# Altium schematic sheet quad_spi_flash.SchDoc
size A
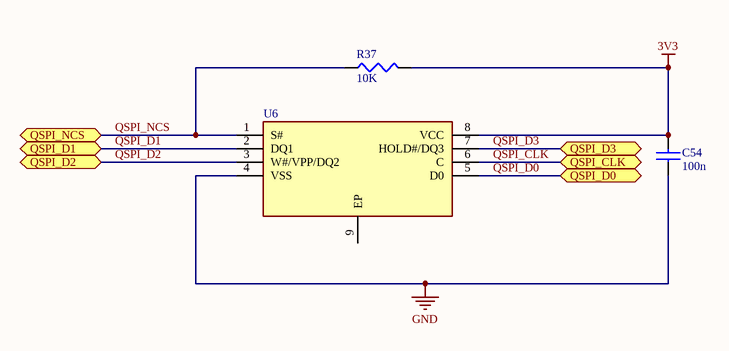
[diagram p0: quad_spi_flash.SchDoc]

## Parts
C54  100n  [C0402]
R37  10K  [R0402]
U6  N25Q128A13EF840E  [SON127P800X600X100-9N-D]  (value not drawn)

## Ports
QSPI_CLK (bidir), QSPI_D0 (bidir), QSPI_D1 (bidir), QSPI_D2 (bidir), QSPI_D3 (bidir), QSPI_NCS (bidir)

## Nets
3V3: C54.2 R37.2 U6.8(VCC)
GND: C54.1 U6.4(VSS)
QSPI_CLK: U6.6(C) ; port QSPI_CLK
QSPI_D0: U6.5(D0) ; port QSPI_D0
QSPI_D1: U6.2(DQ1) ; port QSPI_D1
QSPI_D2: U6.3(W#/VPP/DQ2) ; port QSPI_D2
QSPI_D3: U6.7(HOLD#/DQ3) ; port QSPI_D3
QSPI_NCS: R37.1 U6.1(S#) ; port QSPI_NCS

Not connected (* = marked no-connect by the designer): U6 9(EP)

## Library data of the parts
C54 = C1005X5R1H104K: CAP CER .10UF 50V X5R 10% 0402; Manufacturer: TDK Corporation; Capacitance: 0.1µF; Value: 100nF; .Checked PCB: used; Category: Capacitors; Supplier Part Number: 445-5942-1-ND; Manufacturer Part Number: C1005X5R1H104K; Operating Temperature: -55°C ~ 85°C; Package / Case: 0402 (1005 Metric); Price 1k [$]: 0.02340; .Checked SCH: used; Voltage - Rated: 50V; Supplier: Digikey; Supplier 1: Digi-Key; Supplier Part Number 1: 445-5942-1-ND; RoHS: RoHS Compliant; Stock 1: 106926; Pricing 1: 1=0.27, 10=0.18, 100=0.072, 250=0.05176, 500=0.0369, 1000=0.027 (USD); Tolerance: ±10%; Temperature Coefficient: X5R; Mounting Type: Surface Mount, MLCC; Applications: General Purpose; Ratings: -; Size / Dimension: 0.039" L x 0.020" W (1.00mm x 0.50mm); Height - Seated (Max): -; Thickness (Max): 0.022" (0.55mm); Lead Spacing: -; Features: -; Packaging: Cut Tape (CT); Lead Style: -; ComponentLink1URL: http://www.tdk.co.jp/tefe02/e412_c.pdf; ComponentLink1Description: http://www.tdk.co.jp/tefe02/e412_c.pdf
R37 = RC0402FR-0710KL: RES 10.0K OHM 1/16W 1% 0402 SMD; Manufacturer: Yageo; Power (Watts): 0.063W, 1/16W; .Checked PCB: used; Temperature Coefficient: ±100ppm/°C; Category: Resistors; Supplier Part Number: 311-10.0KLRCT-ND; Manufacturer Part Number: RC0402FR-0710KL; Package / Case: 0402 (1005 Metric); Price 1k [$]: 0.01421; Resistance (Ohms): 10K; Tolerance: ±1%; Value: 10k; .Checked SCH: used; Supplier: Digikey; Supplier 1: Digi-Key; Supplier Part Number 1: 311-10.0KLRCT-ND; RoHS: RoHS Compliant; Stock 1: 2916495; Pricing 1: 10=0.014, 50=0.0104, 100=0.0079, 250=0.00584, 500=0.00432, 1000=0.00288 (USD); Composition: Thick Film; Features: -; Size / Dimension: 0.039" L x 0.020" W (1.00mm x 0.50mm); Height: 0.016" (0.40mm); Number of Terminations: 2; Packaging: Cut Tape (CT); ComponentLink1URL: http://www.yageo.com/documents/recent/PYu-RC0402_51_RoHS_L_6.pdf; ComponentLink1Description: http://www.yageo.com/documents/recent/PYu-RC0402_51_RoHS_L_6.pdf
U6 = N25Q128A13EF840E: Integrated Circuit; Manufacturer_Name: Micron; Datasheet Link: http://www.micron.com/~/media/Documents/Products/Data%20Sheet/NOR%20Flash/Serial%20NOR/N25Q/n25q_128mb_3v_65nm.pdf; Height: 1mm; Manufacturer_Part_Number: N25Q128A13EF840E; Mouser Part Number: 340-182262; Mouser Price/Stock: https://www.mouser.com/Search/Refine.aspx?Keyword=340-182262